# EAGLE design SpySpeakerSchematic (EAGLE 9.5.2)
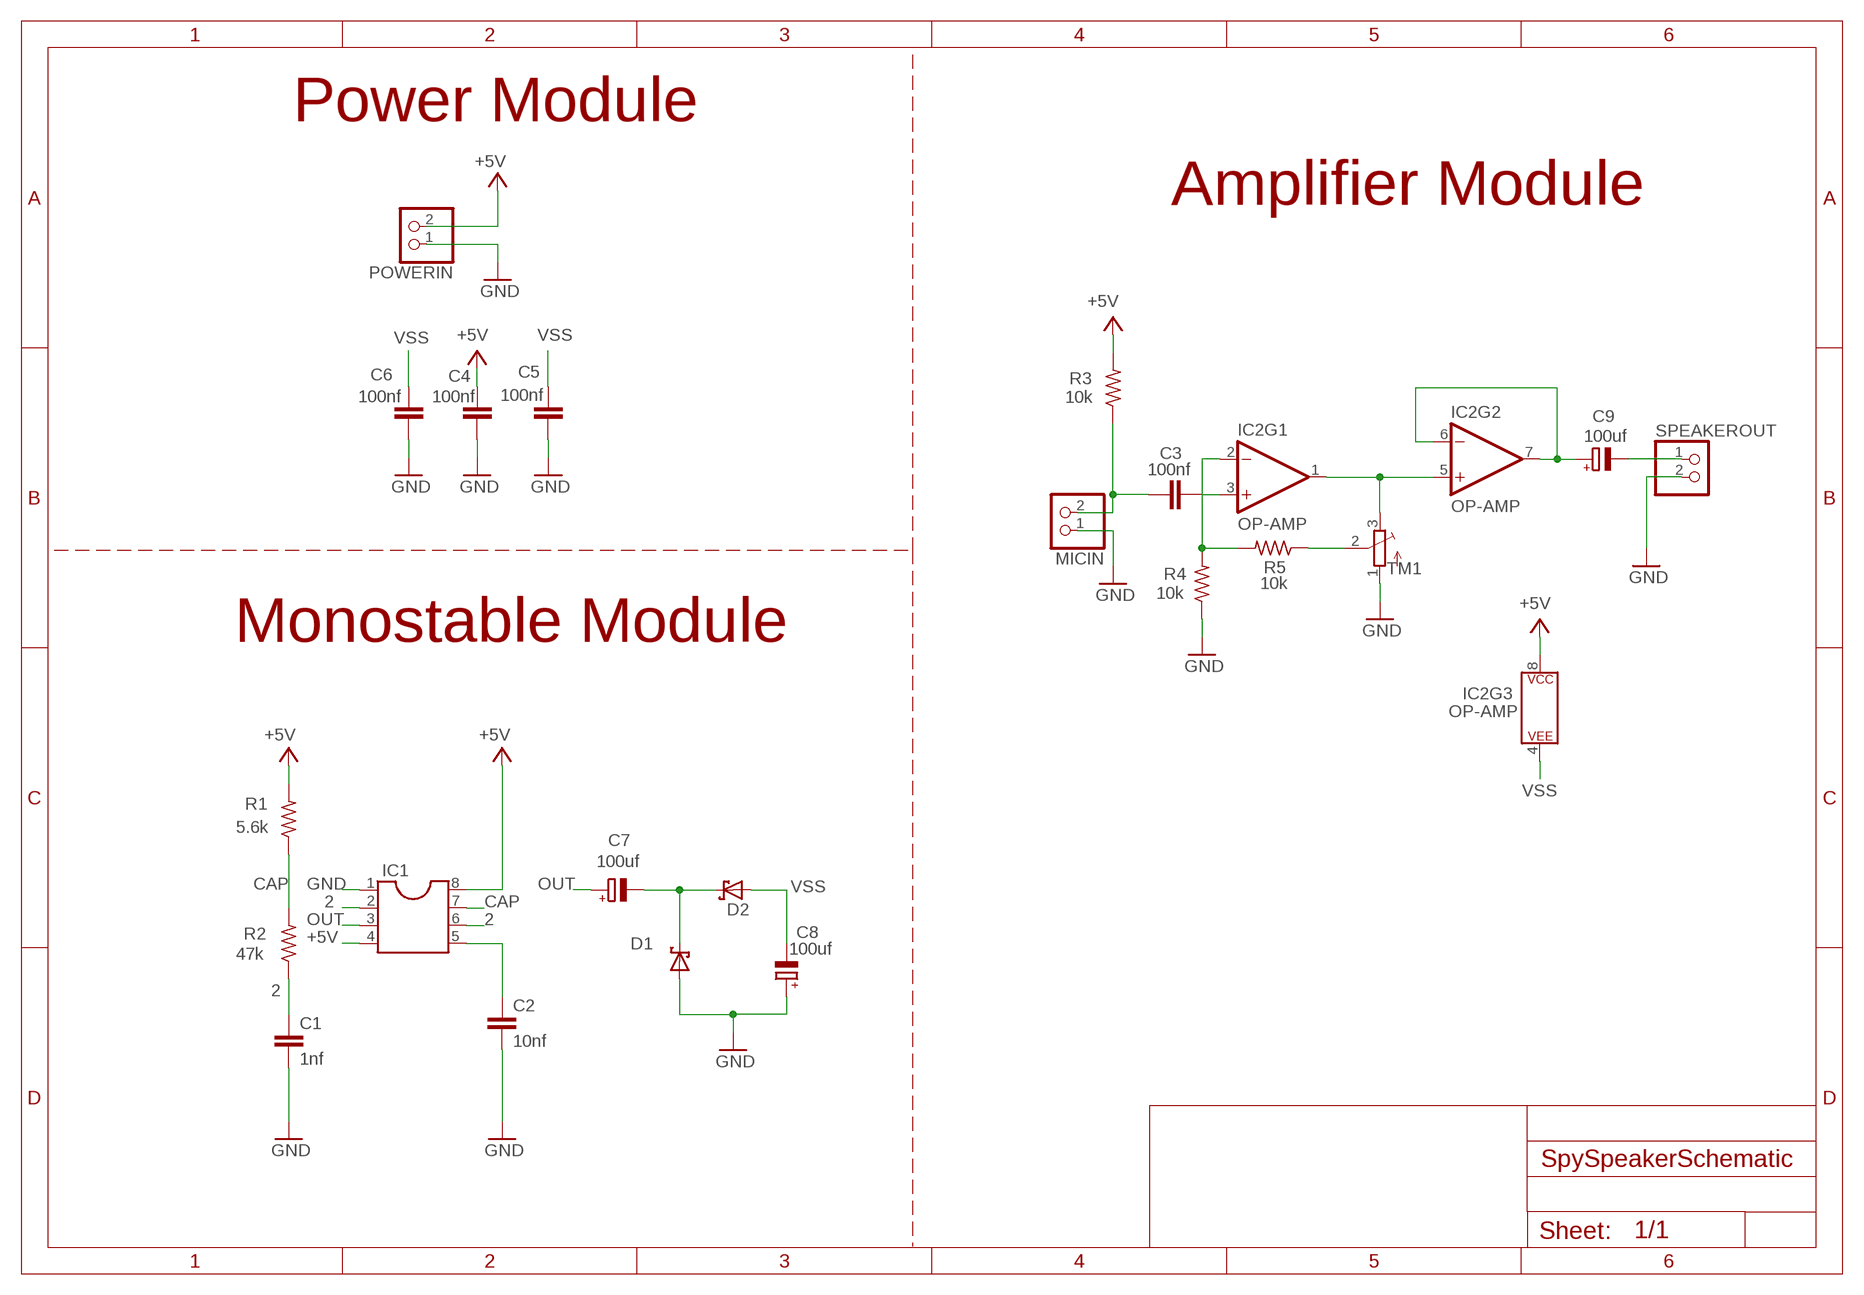
[diagram p0: schematic, sheet 1]

## Parts
C1  1nf  C-EU025-025X050  [C025-025X050]
C2  10nf  C-EU025-025X050  [C025-025X050]
C3  100nf  C-EU025-025X050  [C025-025X050]
C4  100nf  C-EU025-025X050  [C025-025X050]
C5  100nf  C-EU025-025X050  [C025-025X050]
C6  100nf  C-EU025-025X050  [C025-025X050]
C7  100uf  CPOL-EUE2-5  [E2-5]
C8  100uf  CPOL-EUE2-5  [E2-5]
C9  100uf  CPOL-EUE2-5  [E2-5]
D1  SCHOTTKY-DIODEDO41-7  [DO41-7]
D2  SCHOTTKY-DIODEDO41-7  [DO41-7]
IC1  DIL8  [DIL08]
IC2  OP-AMP  OPAMP-DUALDIP  [DIP08]
MICIN  PINHD-1X2  [1X02]
POWERIN  PINHD-1X2  [1X02]
R1  5.6k  R-US_0204/5  [0204/5]
R2  47k  R-US_0204/5  [0204/5]
R3  10k  R-US_0204/5  [0204/5]
R4  10k  R-US_0204/5  [0204/5]
R5  10k  R-US_0204/5  [0204/5]
SPEAKEROUT  PINHD-1X2  [1X02]
TM1  TRIMPOT3386  [TRIM-3386]

## Nets
2: C1.1 IC1.2 IC1.6 R2.1
+5V: C4.1 IC1.4 IC1.8 IC2.8(P$V+) POWERIN.2 R1.2 R3.2
CAP: IC1.7 R1.1 R2.2
GND: C1.2 C2.2 C4.2 C5.2 C6.2 C8.+ D1.A IC1.1 MICIN.1 POWERIN.1 R4.1 SPEAKEROUT.2 TM1.1(A)
N$1: C7.- D1.C D2.C
N$2: C3.1 MICIN.2 R3.1
N$3: R5.1 TM1.2(S)
N$4: C2.1 IC1.5
N$5: C3.2 IC2.3(+IN)
N$6: IC2.1(OUT) IC2.5(+IN) TM1.3(E)
N$7: IC2.2(-IN) R4.2 R5.2
N$8: C9.+ IC2.6(-IN) IC2.7(OUT)
N$9: C9.- SPEAKEROUT.1
OUT: C7.+ IC1.3
VSS: C5.1 C6.1 C8.- D2.A IC2.4(P$V-)

## Notes on the sheet
- Power Module
- Amplifier Module
- Monostable Module

## Library data of the parts
C1-C6 = rcl:C-EU: CAPACITOR, European symbol; SPICEPREFIX: C
C7-C9 = rcl:CPOL-EU: POLARIZED CAPACITOR, European symbol; SPICEPREFIX: C
D1 D2 = adafruit:SCHOTTKY-DIODE: Schottky Diode
IC1 = ic-package:DIL8: Dual In Line / Socket
IC2 = SparkFun-IC-Amplifiers:OPAMP-DUAL: Generic op-amp footprint This component is for the standard 358 pinning of a dual op-amp From the LM358 datasheet: Pin 1: Output A Pin 2: Inverting Input A Pin 3: Non-Inverting Input A Pin 4: Gnd Pin 5: Non-Inverting Input B Pin 6: Inverting Input B Pin 7: Output B Pin 8: V+; PROD_ID: NA-XXXXX
MICIN POWERIN SPEAKEROUT = pinhead:PINHD-1X2: PIN HEADER
R1-R5 = adafruit:R-US_: RESISTOR, American symbol
TM1 = adafruit:TRIMPOT: SMT trimmer potentiometer part number TC33X http://www.ladyada.net/library/eagle

## Board
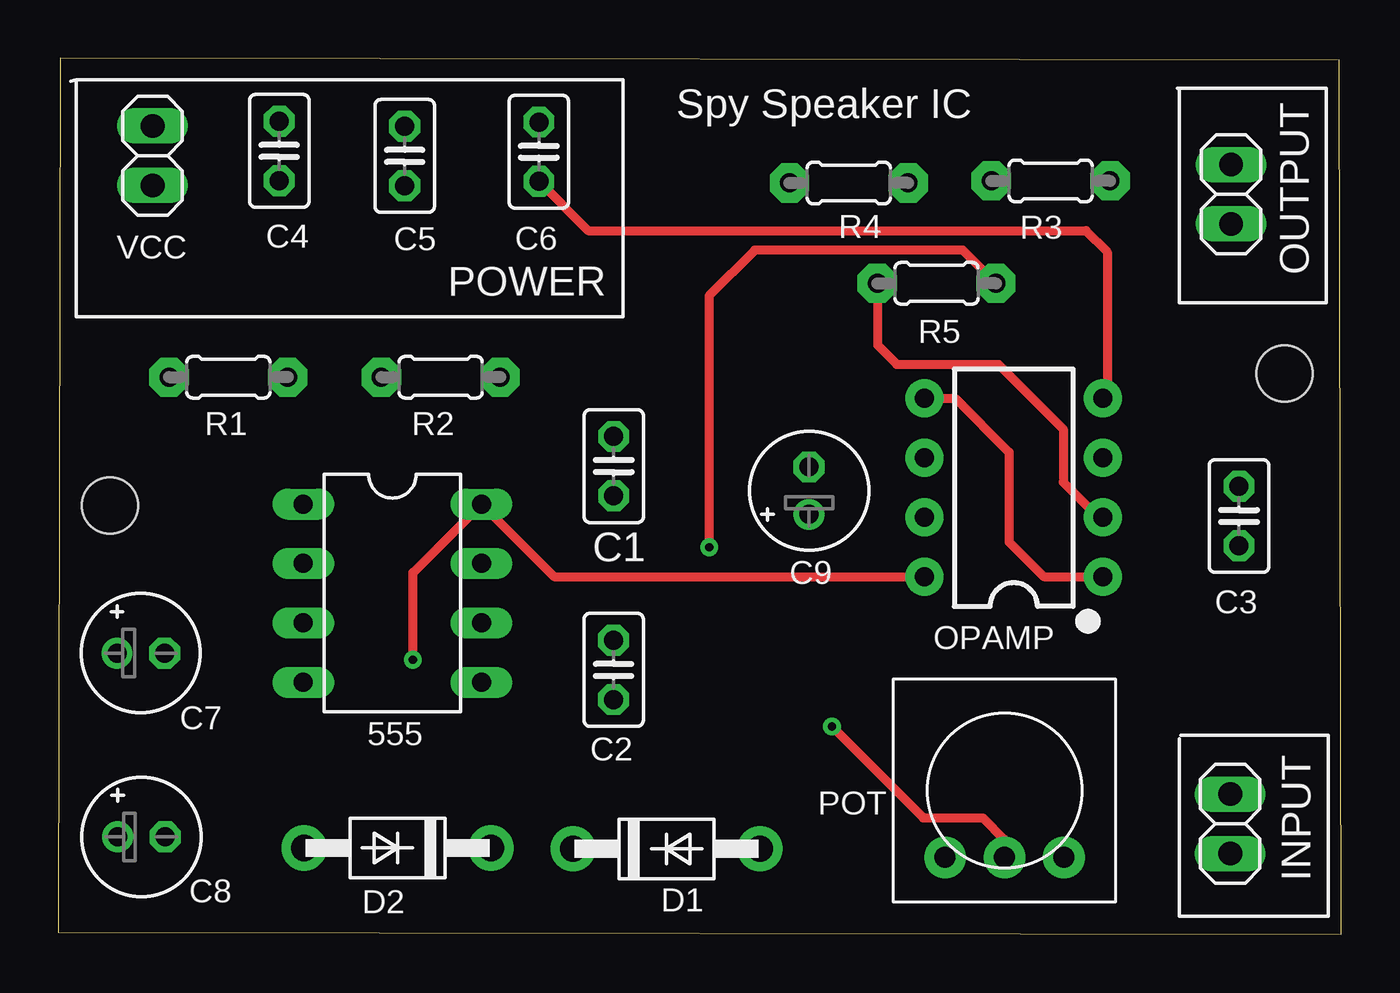
[diagram p1: board, top side]
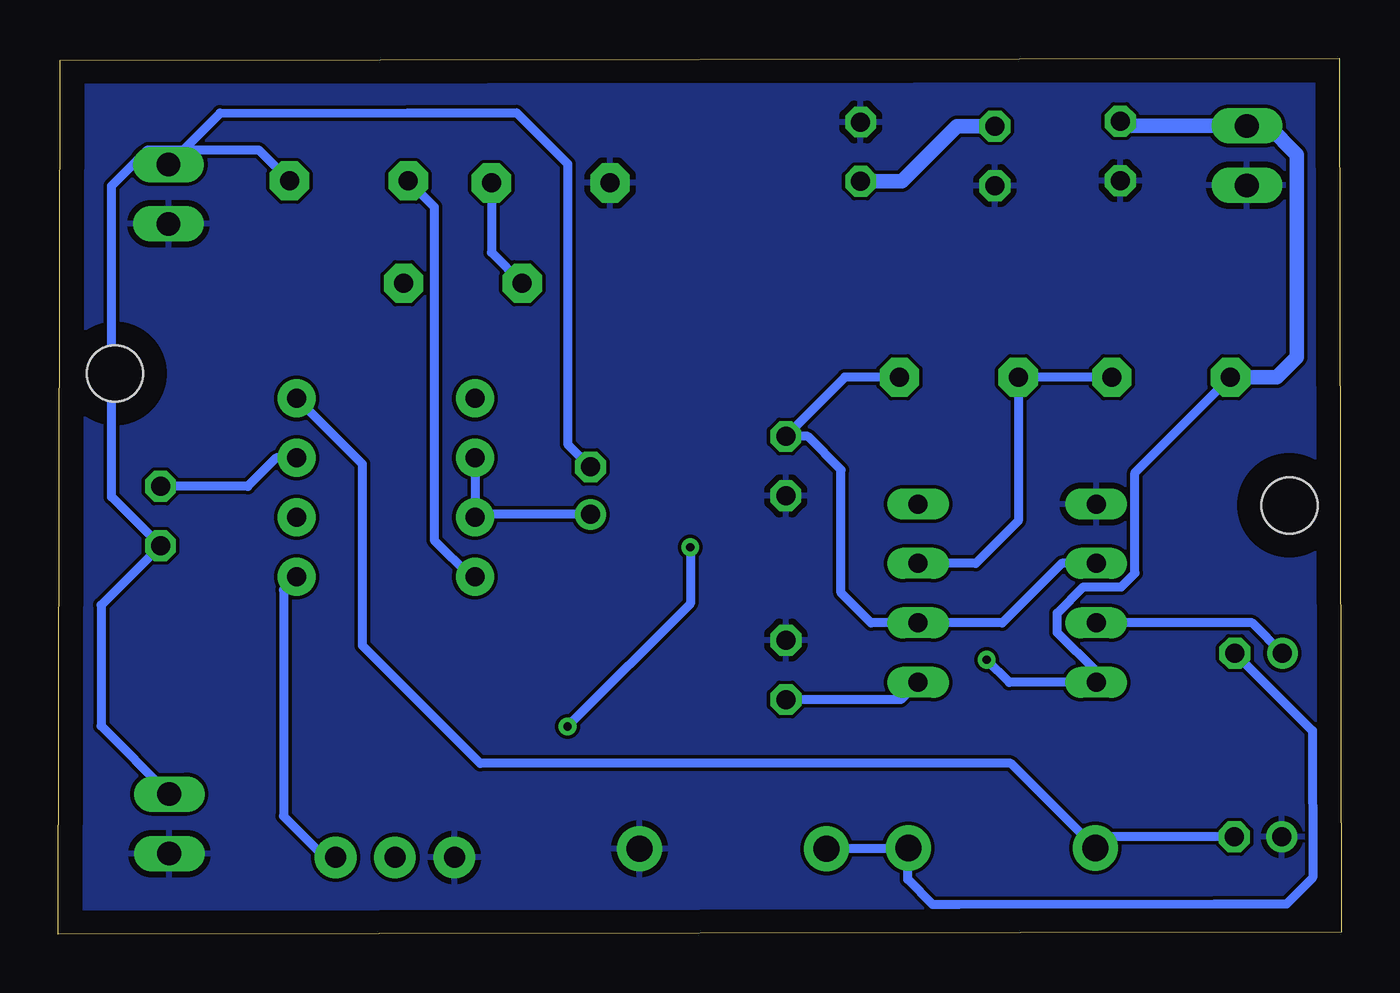
[diagram p2: board, bottom side, seen from below]

Size 54.85 x 37.44 mm. Coordinates in mm from the lower left corner, seen from the top.
Outline: 0,0.09 54.85,0 54.78,37.35 0.08,37.44 0,0.09
Copper layers (1*16): Top 0.035mm / dielectric 1.5mm / Bottom 0.035mm
Design rules "default": minimum track width 6mil, minimum drill 0.35mm, track to track 6mil, track to pad 6mil, pad to pad 6mil, via to via 6mil, smd to smd 6mil, copper to edge 40mil, drill to drill 6mil, minimum pad ring 10mil, minimum via ring 8mil, stop-mask expansion 4mil, vias tented up to drill 0mil, thermal gap 10mil
Holes 2.4 mm at 2.21,18.34 52.43,23.96

### Footprints (pad centres in the part's own frame; a part is rotated, then mirrored left to right if it is on the bottom)
C025-025X050 = drill 0.813 octagon: 1 -1.27,0; 2 1.27,0
E2-5 = drill 0.813 pad 1.27: + -1.016,0 | drill 0.813 pad 1.27 octagon: - 1.016,0
DO41-7 = drill 1.118 pad 1.93: A 4,0; C -4,0
DIL08 = drill 0.813 long: 1 -3.81,-3.81; 2 -1.27,-3.81; 3 1.27,-3.81; 4 3.81,-3.81; 5 3.81,3.81; 6 1.27,3.81; 7 -1.27,3.81; 8 -3.81,3.81
DIP08 = drill 0.813 pad 1.626: 1 -3.81,-3.81; 2 -1.27,-3.81; 3 1.27,-3.81; 4 3.81,-3.81; 5 3.81,3.81; 6 1.27,3.81; 7 -1.27,3.81; 8 -3.81,3.81
1X02 = drill 1.016 long: 1 -1.27,0; 2 1.27,0
0204/5 = drill 0.813 pad 1.676 octagon: 1 -2.54,0; 2 2.54,0
TRIM-3386 = drill 0.9 pad 1.778: 1 -2.54,-2.857; 2 0,-2.857; 3 2.54,-2.857

### Placement (x,y rotation side)
C1  23.75,20.01 270 top
C2  23.74,11.3 90 top
C3  50.49,17.88 90 top
C4  9.44,33.49 270 top
C5  14.81,33.27 270 top
C6  20.54,33.45 90 top
C7  3.52,12.02 0 top
C8  3.54,4.16 0 top
C9  32.1,18.96 90 top
D1  26,3.65 0 top
D2  14.51,3.69 180 top
IC1  14.28,14.58 270 top
IC2  40.85,19.09 90 top
MICIN  50.11,4.72 90 top
POWERIN  4.03,33.28 90 top
R1  7.27,23.81 180 top
R2  16.35,23.81 180 top
R3  42.43,32.2 180 top
R4  33.8,32.11 0 top
R5  37.55,27.83 180 top
SPEAKEROUT  50.14,31.63 270 top
TM1  40.46,6.14 0 top

### Tracks (layer width: path | path; a pad name or v marks a point on that pad's centre or on a via)
2
  Bottom 0.381: R2.1 21.22,23.81 C1.1 22.81,21.28 21.38,19.85 21.38,14.59 20.1,13.31 IC1.6 14.48,13.31 11.94,15.85 IC1.2
+5V  (via drill 0.35)
  Top 0.381: v15.16,11.74 15.16,15.45 IC1.8 21.2,15.28 IC2.8
  Bottom 0.381: R1.2 8.81,19.73 8.81,15.43 9.4,14.85 11.01,14.85 12.14,13.73 12.14,12.89 10.47,11.23 IC1.4 14.19,10.77 v15.16,11.74 | R3.2 38.78,31.09 38.78,16.85 37.21,15.28 IC2.8
  Bottom 0.61: C4.1 9.24,34.55 POWERIN.2 3.11,34.55 1.89,33.32 1.89,24.67 2.75,23.81 R1.2
CAP
  Bottom 0.381: R1.1 R2.2 13.81,17.67 15.62,15.85 IC1.7
GND
  pour Bottom: 0.16,0.24 0.24,0.16 54.26,0.16 54.26,36.79 54.1,36.94 0.16,36.87
N$1
  Bottom 0.381: C7.- 1.23,8.71 1.21,2.41 2.34,1.29 5.41,1.28 16.36,1.27 17.46,1.27 18.53,2.34 18.53,3.66 D2.C 18.54,3.65 D1.C
N$2
  Bottom 0.381: MICIN.2 53.02,8.9 53.02,14.07 C3.1 52.57,18.69 52.57,31.99 51.03,33.53 46.29,33.53 R3.1
N$3  (via drill 0.35)
  Top 0.381: R5.1 38.67,29.25 29.78,29.25 27.83,27.29 v27.83,16.55 | v33.08,8.88 36.99,4.97 39.53,4.97 40.46,4.04 TM1.2
  Bottom 0.381: v27.83,16.55 27.83,14.13 v33.08,8.88
N$4
  Bottom 0.381: IC1.5 18.83,10.03 C2.1
N$5
  Bottom 0.381: IC2.3 45.54,20.36 46.75,19.15 C3.2
N$6
  Top 0.381: IC2.5 38.35,22.9 40.65,20.61 40.65,16.77 42.13,15.28 IC2.1
  Bottom 0.381: IC2.1 45.22,14.72 45.22,5.05 43.46,3.29 TM1.3
N$7
  Top 0.381: R5.2 35.03,27.81 35.03,25.19 35.85,24.36 40.2,24.36 42.97,21.59 42.97,19.33 44.48,17.82 IC2.2
  Bottom 0.381: R4.2 36.34,29.15 R5.2
N$8
  Bottom 0.381: C9.+ 36.92,17.94 36.93,17.93 | 36.93,17.93 IC2.7 | IC2.6 37.04,18.04 36.93,17.93
N$9
  Bottom 0.381: SPEAKEROUT.1 47.94,35.1 39.9,35.12 35.24,35.12 35.25,35.11 33.08,32.93 33.08,20.95 C9.-
OUT
  Bottom 0.381: C7.+ 3.8,13.31 IC1.3
VSS
  Top 0.381: C6.1 22.65,30.07 43.95,30.07 44.85,29.17 44.85,23.09 IC2.4
  Bottom 0.381: C8.- 10.03,4.16 D2.A 14.12,7.3 36.81,7.3 41.85,12.34 41.85,20.09 IC2.4
  Bottom 0.61: C5.1 16.42,34.54 18.78,32.18 C6.1

### Text on the board
tNames: Spy Speaker IC | VCC | OUTPUT | POWER | OPAMP | 555 | POT | INPUT